# EAGLE design potentiometer_for_5_pin_v1 (EAGLE 7.2.0)
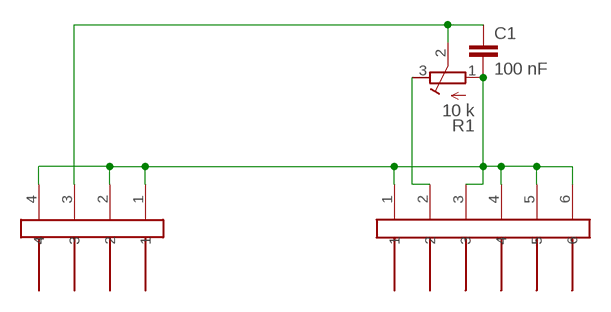
[diagram p0: schematic, sheet 1]

## Parts
C1  100 nF  C-EUC0805  [C0805]
R1  10 k  R-TRIM  [R-TRIM]
U$8  JUMPER6M  [JUMPER6M]
U$9  JUMPER4M  [JUMPER4M]

## Nets
GND: C1.2 R1.1(E) U$8.1 U$8.3 U$8.4 U$8.5 U$8.6 U$9.1 U$9.2 U$9.4
N$1: C1.1 R1.2(S) U$9.3
N$2: R1.3(A) U$8.2

## Library data of the parts
C1 = resistor:C-EU: CAPACITOR, European symbol
R1 = !stavebnice03:R-TRIM
U$8 = !stavebnice03:JUMPER6M
U$9 = !stavebnice03:JUMPER4M

## Board
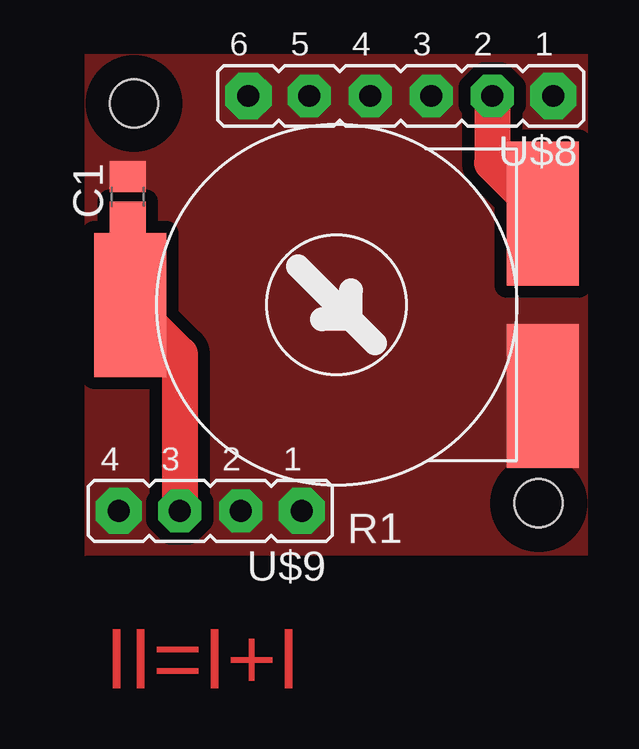
[diagram p1: board, top side]

No outline drawn. Coordinates in mm, seen from the top.
Copper layers (1*16): Top 0.035mm / dielectric 1.5mm / Bottom 0.035mm
Design rules "default": minimum track width 10mil, minimum drill 24mil, track to track 8mil, track to pad 8mil, pad to pad 8mil, via to via 8mil, smd to smd 8mil, copper to edge 40mil, drill to drill 8mil, minimum pad ring 10mil, minimum via ring 8mil, stop-mask expansion 4mil, vias tented up to drill 0mil, thermal gap 10mil
Holes 2 mm at 2.06,18.89 18.92,2.22

### Footprints (pad centres in the part's own frame; a part is rotated, then mirrored left to right if it is on the bottom)
C0805 = smd 1.3 x 1.5: 1 -0.85,0; 2 0.85,0
R-TRIM = smd 6 x 3: 1 -3.8,-8.6; 2 0,8.6; 3 3.8,-8.6
JUMPER6M = drill 0.914 pad 1.93 octagon: 1 -6.35,0; 6 6.35,0 | drill 0.914 pad 1.778 octagon: 2 -3.81,0; 3 -1.27,0; 4 1.27,0; 5 3.81,0
JUMPER4M = drill 0.914 pad 1.93 octagon: 1 -3.81,0; 4 3.81,0 | drill 0.914 pad 1.778 octagon: 2 -1.27,0; 3 1.27,0

### Placement (x,y rotation side)
C1  1.8,15 90 top
R1  10.5,10.5 90 top
U$8  13.18,19.21 180 top
U$9  5.24,1.91 180 top

### Tracks (layer width: path | path; a pad name or v marks a point on that pad's centre or on a via)
GND
  pour Top (isolate 0.508, rank 2, no thermals): 0.03,0.03 0.03,20.95 20.95,20.95 20.95,0.05
N$1
  Top 0.356: C1.1 R1.2
  Top 1.5: R1.2 3.97,8.43 U$9.3
N$2
  Top 1.5: U$8.2 16.99,16.41 R1.3

### Text on the board
Top: II=I+I
centerDrill: trim for 5 pin interface v1